# Altium schematic sheet MCU_POWER.SchDoc
size A; SheetNumber: 5; SheetTotal: 9
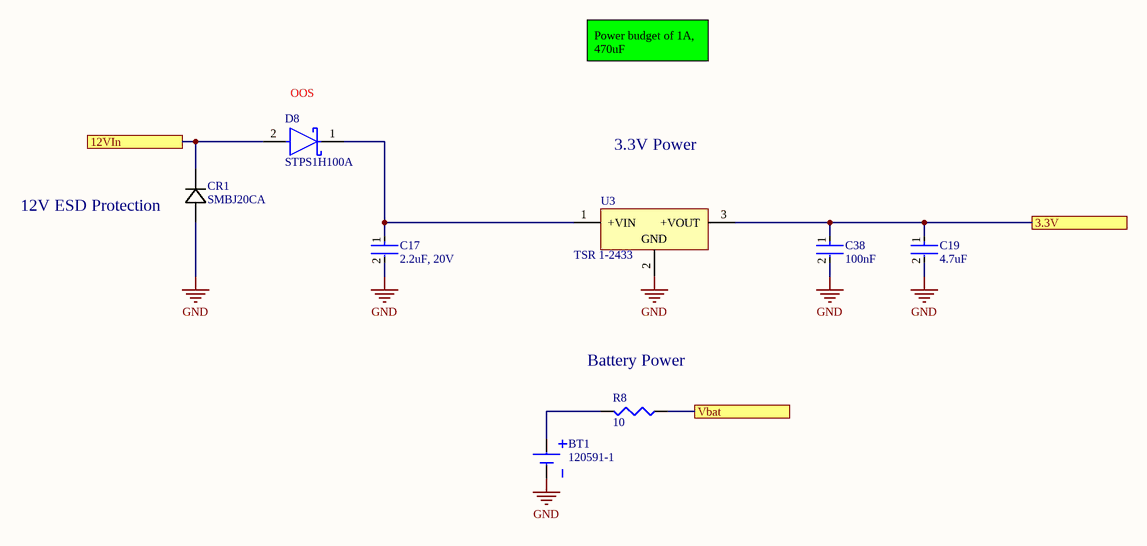
[diagram p0: MCU_POWER.SchDoc]

## Parts
BT1  120591-1  [TECO-120591-1-2_V]
C17  2.2uF, 20V  [FP-C0603C-CF-MFG]
C19  4.7uF  [FP-C0603C-CF-MFG]
C38  100nF  [FP-C0603C-CF-MFG]
CR1  SMBJ20CA  [SMB]
D8  STPS1H100A  [FP-SMA-MFG]
R8  10  [J1-0603]
U3  TSR 1-2433  [TRACO-SIP-3_V]

## Ports
3.3V, 12VIn, Vbat

## Nets
GND: BT1.2(-) C17.2 C19.2 C38.2 CR1.2 U3.2(GND)
3.3V: C19.1 C38.1 U3.3(+VOUT) ; port 3.3V
12VIn: CR1.1 D8.2(A) ; port 12VIn
Vbat: R8.1 ; port Vbat
NetBT1_1: BT1.1(+) R8.2
NetC17_1: C17.1 D8.1(K) U3.1(+VIN)

## Notes on the sheet
- (near D8) OOS
- Power budget of 1A, 470uF
- 3.3V Power
- (near CR1) 12V ESD Protection
- (near R8) Battery Power

## Library data of the parts
BT1 = CMP-0438-00001-2: Lithium Battery Holder for CR2032 3V Cell; Manufacturer: TE Connectivity; Packing Type: Tray; Body Shape: Horizontal Cylindrical; AccessRights: 2147483647; RevisionId: 1; Folder: Unified Components\Components\TE Connectivity\Connectors & Connector Components\Power Products\Battery Interconnection Products\; ContentType: Unified Component; ContentTypeGUID: CB3C11C4-E317-11DF-B822-12313F0024A2; ComponentLink1Description: Manufacturer URL; LifeCycleStateGUID: 61E382EE-6656-4F12-9E24-BE9327104A25; FolderGUID: A6761B51-D489-48A3-9180-F4808F45AB79; PartNumber: 120591-1; LifeCycle: Released; ReleaseDate: 20/08/2013 02:50:22 AM; PackageReference: 120591-1; ComponentLink2URL: http://www.te.com/commerce/DocumentDelivery/DDEController?Action=showdoc&DocId=Customer+Drawing%7F120591%7FH%7Fpdf%7FEnglish%7FENG_CD_120591_H.pdf%7F120591-1; DatasheetVersion: Rev. H, 01/2013; PackageDescription: Lithium Battery Holder; ItemGUID: B2C50140-681E-4F62-8DBB-9728605318CE; ItemHRID: CMP-0438-00001; Mounting Technology: Through Hole; ComponentLink1URL: http://www.te.com/; ComponentLink2Description: Datasheet
C17 C19 C38 = CMP-2006-03061-2: Any 0603 Cap is fine here; Manufacturer: KEMET; Manufacturer Part Number: C0603C104K5RACTU; Tolerance: 0.1; Temperature Coefficient: 30ppm/°C; Material: Ceramic; Automotive Grade: Grade 1; Voltage Rating: 50 V; Value: 0.10 μF; Temperature Characteristic: X7R; Temperature: -55°C to +125°C; RoHS: TRUE; Temperature Range High: +125°C; Lead Free: Yes; Octopart: https://octopart.com/c0603c104k5ractu-kemet-139244; Digikey Description: CAP CER 0.1UF 50V X7R 0603; Category: Cap; Package: C0603C-CF; ComponentLink2Description: Datasheet; Temperature Range Low: -55°C; Device Class L1: Passive Components; Automotive: Yes; Device Class L3: Ceramic Capacitors; ComponentLink2URL: https://api.kemet.com/component-edge/download/datasheet/C0603C100J5GACAUTO.pdf; Capacitance: 0.10 μF; Device Class L2: Capacitors; Height: 0.87mm
CR1 = SMBJ20CA: Imported; Vendor: Bourns Electronics; Built_By: EMA_UL_Team; Type: DEV; C: Copyright (C) 2015 Accelerated Designs. All rights reserved; Manufacturer_Part_Number: SMBJ20CA; RefDes: RefDes; Value: Value; Part Number: SMBJ20CA
D8 = CMP-2000-07173-2: DIODE SCHOTTKY 100V 1A SMA; Manufacturer: STMicroelectronics; Standoff Height: 0.05mm; Peak Reverse Current: 4uA; Max Junction Temp: +175°C; Max Surge Forward Current: 50A; Temperature Range High: +175°C; Device Class L3: Schottky Diodes; Height: 2.65mm; Manufacturer Part Number: STPS1H100A; ComponentLink2URL: https://www.st.com/resource/en/datasheet/stps1h100.pdf; Category: Diode; RoHS: TRUE; Automotive: No; Digikey Description: DIODE SCHOTTKY 100V 1A SMA; Mouser Description: Schottky Diodes & Rectifiers 1.0 Amp 100 Volt; Device Class L2: Diodes; ComponentLink2Description: Datasheet; Forward Current: 1A; Package: SMA; Octopart: https://octopart.com/stps1h100a-stmicroelectronics-55399361; Temperature: to +175°C; Max Repetitive Reverse Voltage: 100V; Lead Free: Yes; Device Class L1: Discrete Semiconductors
R8 = Res3: Resistor; Published: 8-Jun-2000; LatestRevisionDate: 29-May-2009; LatestRevisionNote: IPC-7351 Footprint Added.; PackageReference: J1-0603; Publisher: Altium Limited; PackageDescription: Chip Resistor; Value: 10
U3 = CMP-2000-05426-1: DC/DC Converter, TSR-1 Series, 3.3 VDC, 1 A, -40 to 85 degC, 3-Pin THD (SIP), RoHS; Manufacturer: Tracopower; No. of Outputs: 1Output; SVHC: NoSVHC(17-Dec-2015); Input Voltage DC Max: 36V; Input Voltage DC Min: 4.75V; DC / DC Converter Output Type: Fixed; Output Voltage Nom.: 3.3V; Output Current Max: 1A; DC / DC Converter Mounting: ThroughHole; Output Power Max: 3.3W; Datasheet URL: https://datasheet.ciiva.com/6815/tsr1-6815641.pdf; Package Reference: SIP-3; Depth: 11.5mm; Manufacturer URL: http://www.tracopower.com/home; Approvals & Standards: -; Width: 7.6mm; Package Description: 3-Pin Single In-line Package, Body 11.7 x 7.6 mm, Pitch 2.54 mm; Product Range: TSR-1Series; DC / DC Converter Type: SIP; Datasheet Version: Jan-15; Height: 10.2mm